# EAGLE design hermes (EAGLE 8.3.0)

## Sheet 1 of 2
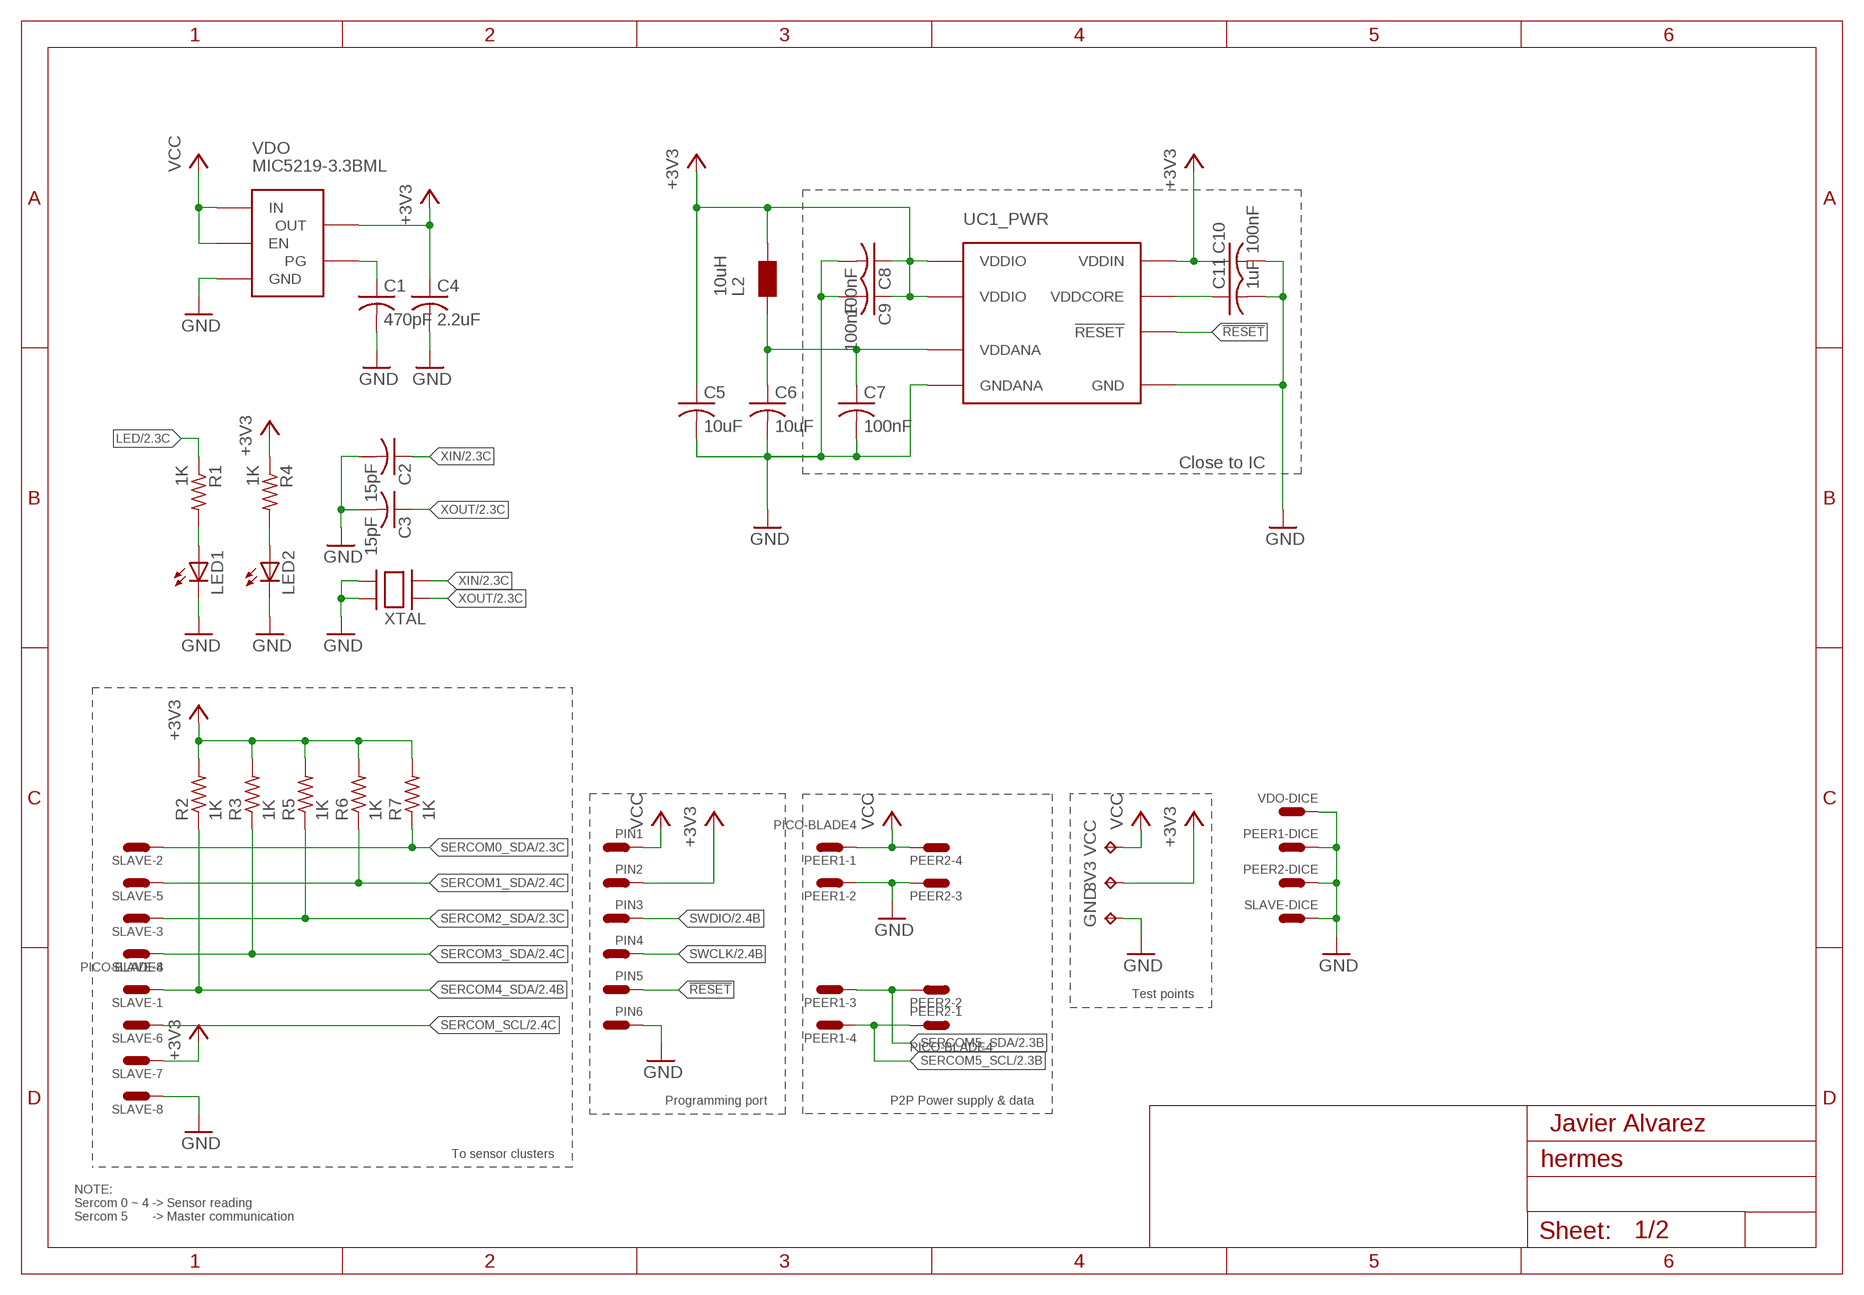
[diagram p0: schematic, sheet 1]

### Parts
3V3  TPB1,27  [B1,27]
C1  470pF  C-USC0201  [C0201]
C2  15pF  C-USC0201  [C0201]
C3  15pF  C-USC0201  [C0201]
C4  2.2uF  C-USC0201  [C0201]
C5  10uF  C-USC0402  [C0402]
C6  10uF  C-USC0402  [C0402]
C7  100nF  C-USC0201  [C0201]
C8  100nF  C-USC0201  [C0201]
C9  100nF  C-USC0201  [C0201]
C10  100nF  C-USC0201  [C0201]
C11  1uF  C-USC0201  [C0201]
GND  TPB1,27  [B1,27]
L2  10uH  SPM5030-HZ  [L2215]
LED1  LED_ESML0603  [LED_SML0603]
LED2  LED_ESML0603  [LED_SML0603]
PEER1  PICO-BLADE4  [PICO-BLADE4]
PEER2  PICO-BLADE4  [PICO-BLADE4]
PIN1  SINGLE-PIN  [PAD5025]
PIN2  SINGLE-PIN  [PAD5025]
PIN3  SINGLE-PIN  [PAD5025]
PIN4  SINGLE-PIN  [PAD5025]
PIN5  SINGLE-PIN  [PAD5025]
PIN6  SINGLE-PIN  [PAD5025]
R1  1K  R-US_R0201  [R0201]
R2  1K  R-US_R0201  [R0201]
R3  1K  R-US_R0201  [R0201]
R4  1K  R-US_R0201  [R0201]
R5  1K  R-US_R0201  [R0201]
R6  1K  R-US_R0201  [R0201]
R7  1K  R-US_R0201  [R0201]
SLAVE  PICO-BLADE8  [PICO-BLADE8]
UC1  ATSAMD20G-QFN48  [QFN-48]
VCC  TPB1,27  [B1,27]
VDO  MIC5219-3.3BML  [MLF-6]
XTAL  LFXTAL059596CUTT  [2X1.6]

### Nets
!RESET: PIN5.P$1 UC1.P$40(_PWR:!RESET)
+3V3: 3V3.TP C4.1 C5.1 C8.1 C9.1 C10.1 L2.P$2 PIN2.P$1 R2.2 R3.2 R4.1 R5.2 R6.2 R7.2 SLAVE.P$9 UC1.P$17(_PWR:VDDIO) UC1.P$36(_PWR:VDDIO) UC1.P$44(_PWR:VDDIN) VDO.P$4(OUT)
GND: C1.2 C2.2 C3.2 C4.2 C5.2 C6.2 C7.2 C8.2 C9.2 C10.2 C11.2 GND.TP LED1.C LED2.C PEER1.P$1 PEER1.P$2 PEER1.P$4 PEER2.P$1 PEER2.P$2 PEER2.P$5 PIN6.P$1 SLAVE.P$1 SLAVE.P$2 SLAVE.P$10 UC1.P$5(_PWR:GNDANA) UC1.P$18(_PWR:GND) UC1.P$35(_PWR:GND) UC1.P$42(_PWR:GND) UC1.P$49(_PWR:GND) VDO.P$2(GND) VDO.P$7 XTAL.GND@1(GND) XTAL.GND@2(GND)
LED: R1.1 ; also sheet 2
N$1: C6.1 C7.1 L2.P$1 UC1.P$6(_PWR:VDDANA)
N$2: C1.1 VDO.P$6(PG)
N$3: C11.1 UC1.P$43(_PWR:VDDCORE)
N$6: LED1.A R1.2
N$7: LED2.A R4.2
SERCOM0_SDA: R7.1 SLAVE.P$4 ; also sheet 2
SERCOM1_SDA: R6.1 SLAVE.P$7 ; also sheet 2
SERCOM2_SDA: R5.1 SLAVE.P$5 ; also sheet 2
SERCOM3_SDA: R3.1 SLAVE.P$6 ; also sheet 2
SERCOM4_SDA: R2.1 SLAVE.P$3 ; also sheet 2
SERCOM5_SCL: PEER1.P$6 PEER2.P$3 ; also sheet 2
SERCOM5_SDA: PEER1.P$5 PEER2.P$4 ; also sheet 2
SERCOM_SCL: SLAVE.P$8 ; also sheet 2
SWCLK: PIN4.P$1 ; also sheet 2
SWDIO: PIN3.P$1 ; also sheet 2
VCC: PEER1.P$3 PEER2.P$6 PIN1.P$1 VCC.TP VDO.P$1(EN) VDO.P$3(IN)
XIN: C2.1 XTAL.XTAL@1(XTAL) ; also sheet 2
XOUT: C3.1 XTAL.XTAL@2(XTAL) ; also sheet 2

### Notes on the sheet
- Close to IC
- Test points
- Programming port | P2P Power supply & data
- Javier Alvarez
- To sensor clusters
- NOTE:
  Sercom 0 ~ 4 -> Sensor reading
  Sercom 5       -> Master communication

## Sheet 2 of 2
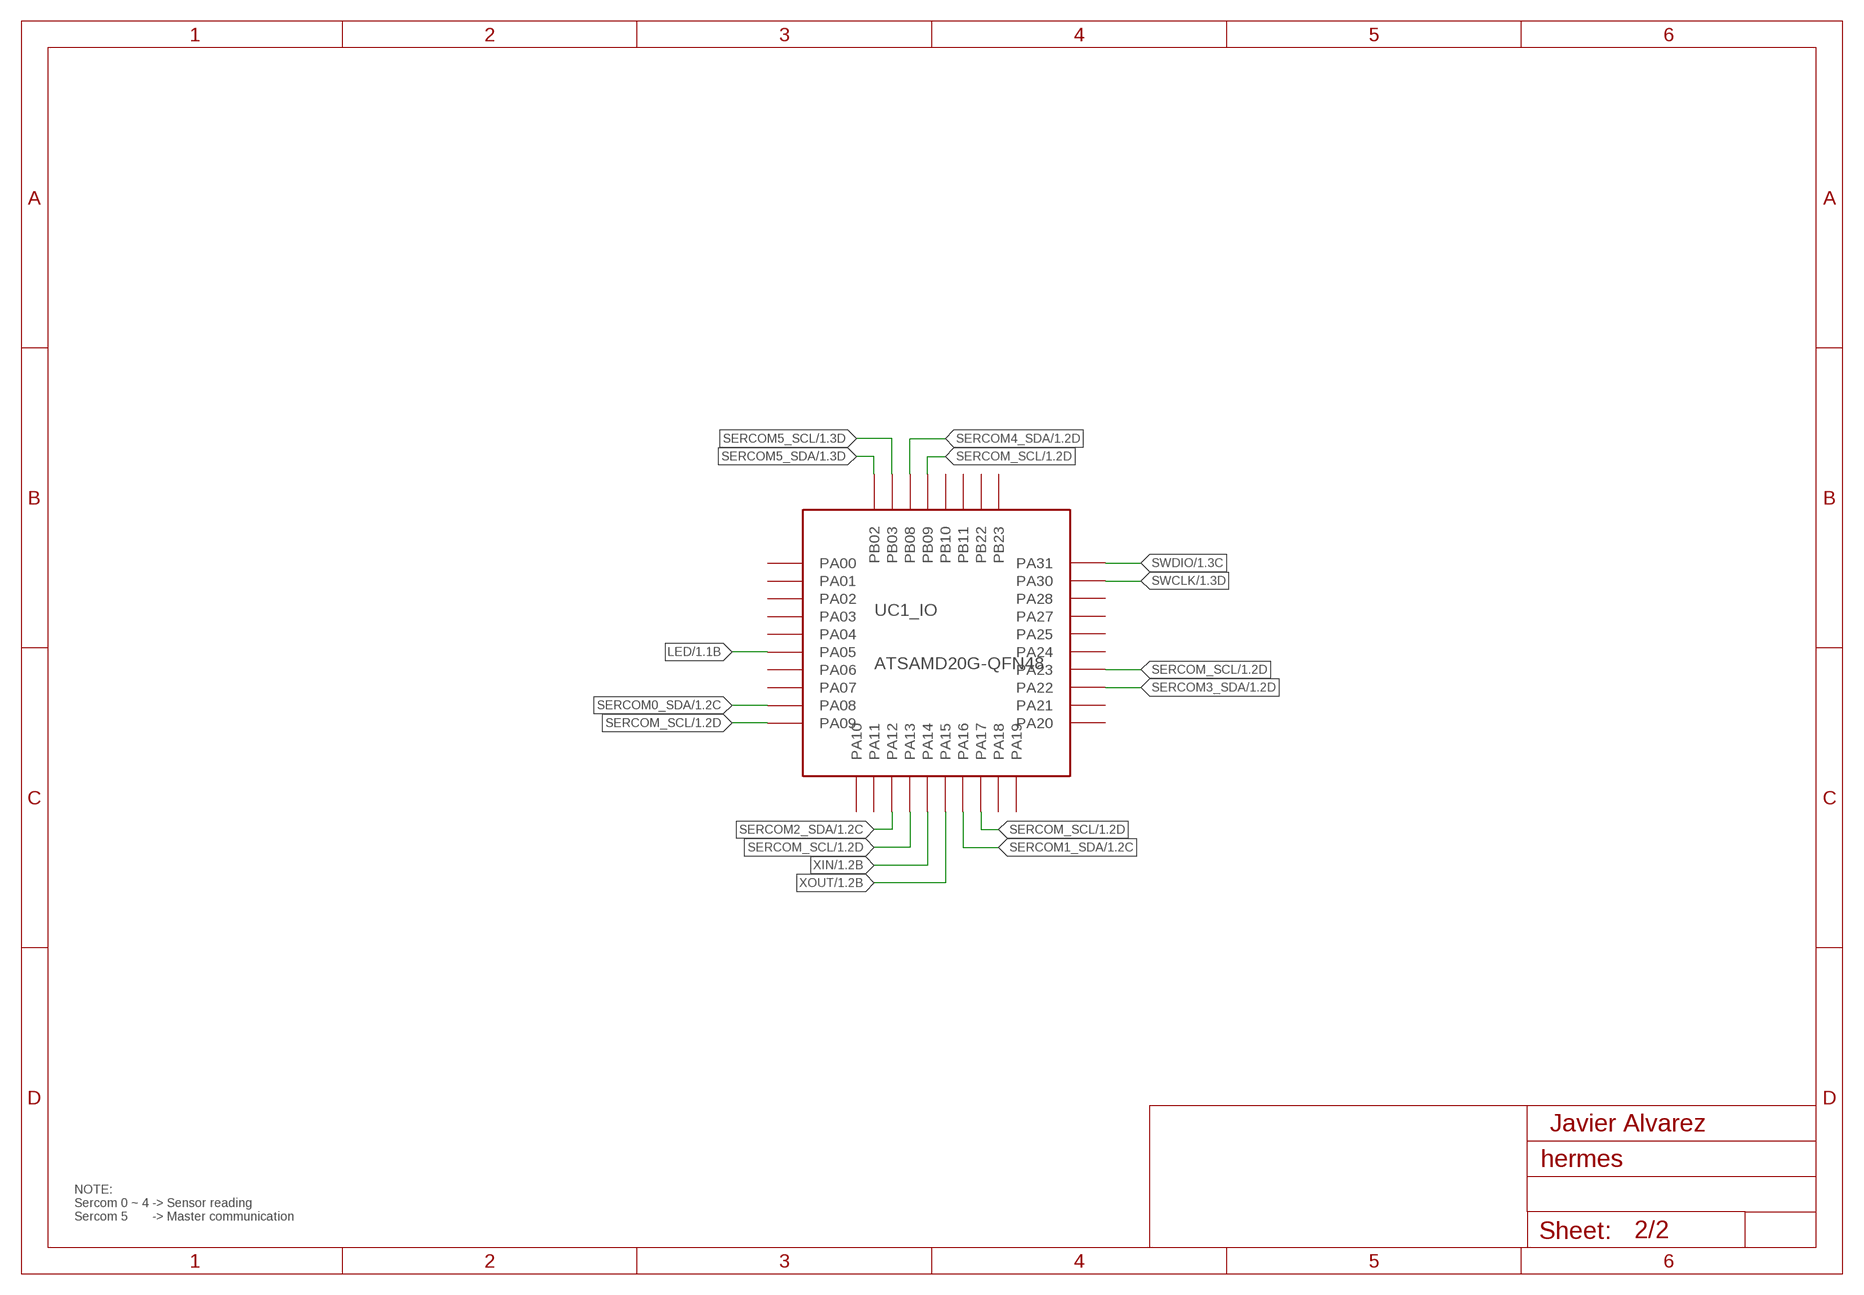
[diagram p1: schematic, sheet 2]

### Nets
LED: UC1.P$10(_IO:PA05) ; also sheet 1
SERCOM0_SDA: UC1.P$13(_IO:PA08) ; also sheet 1
SERCOM1_SDA: UC1.P$25(_IO:PA16) ; also sheet 1
SERCOM2_SDA: UC1.P$21(_IO:PA12) ; also sheet 1
SERCOM3_SDA: UC1.P$31(_IO:PA22) ; also sheet 1
SERCOM4_SDA: UC1.P$7(_IO:PB08) ; also sheet 1
SERCOM5_SCL: UC1.P$48(_IO:PB03) ; also sheet 1
SERCOM5_SDA: UC1.P$47(_IO:PB02) ; also sheet 1
SERCOM_SCL: UC1.P$8(_IO:PB09) UC1.P$14(_IO:PA09) UC1.P$22(_IO:PA13) UC1.P$26(_IO:PA17) UC1.P$32(_IO:PA23) ; also sheet 1
SWCLK: UC1.P$45(_IO:PA30) ; also sheet 1
SWDIO: UC1.P$46(_IO:PA31) ; also sheet 1
XIN: UC1.P$23(_IO:PA14) ; also sheet 1
XOUT: UC1.P$24(_IO:PA15) ; also sheet 1
Unconnected: UC1.P$1(_IO:PA00) UC1.P$2(_IO:PA01) UC1.P$3(_IO:PA02) UC1.P$4(_IO:PA03) UC1.P$9(_IO:PA04) UC1.P$11(_IO:PA06) UC1.P$12(_IO:PA07) UC1.P$15(_IO:PA10) UC1.P$16(_IO:PA11) UC1.P$19(_IO:PB10) UC1.P$20(_IO:PB11) UC1.P$27(_IO:PA18) UC1.P$28(_IO:PA19) UC1.P$29(_IO:PA20) UC1.P$30(_IO:PA21) UC1.P$33(_IO:PA24) UC1.P$34(_IO:PA25) UC1.P$37(_IO:PB22) UC1.P$38(_IO:PB23) UC1.P$39(_IO:PA27) UC1.P$41(_IO:PA28)

### Notes on the sheet
- Javier Alvarez
- NOTE:
  Sercom 0 ~ 4 -> Sensor reading
  Sercom 5       -> Master communication

## Library data of the parts
3V3 GND VCC = testpad:TP: Test pad
C1-C11 = rcl:C-US: CAPACITOR, American symbol
L2 = Hermes_lib:SPM5030-HZ
LED1 LED2 = eagle-ltspice:LED_E: LED Source: http://www.osram.convergy.de Source: www.luxeon.com Source: www.kingbright.com; SPICEMODEL: NONE; SPICEPREFIX: D; SPICETYPE: diode
PEER1 PEER2 = Hermes_lib:PICO-BLADE4
PIN1-PIN6 = Hermes_lib:SINGLE-: Single pad 50x25 mil Single general purpose pad
R1-R7 = rcl:R-US_: RESISTOR, American symbol
SLAVE = Hermes_lib:PICO-BLADE8
UC1 = Hermes_lib:ATSAMD20G-: Low-Power, 32-bit Cortex-M0+ MCUs with 12-bit ADC, 10-bit DAC, 256-Channel PTC, RTC, and SERCOM Datasheet <http://ww1.microchip.com/downloads/en/DeviceDoc/60001504B.pdf>
VDO = Hermes_lib:MIC5219-: MIC5219 500mA-Peak Output LDO Regulator Datasheet <http://www.mouser.com/ds/2/268/mic5219-779135.pdf>
XTAL = Hermes_lib:LFXTAL059596CUTT: LFXTAL059596Cutt Quartz Crystal Specification Datasheet <http://www.mouser.com/ds/2/741/LFXTAL059596Cutt-948066.pdf>

## Board
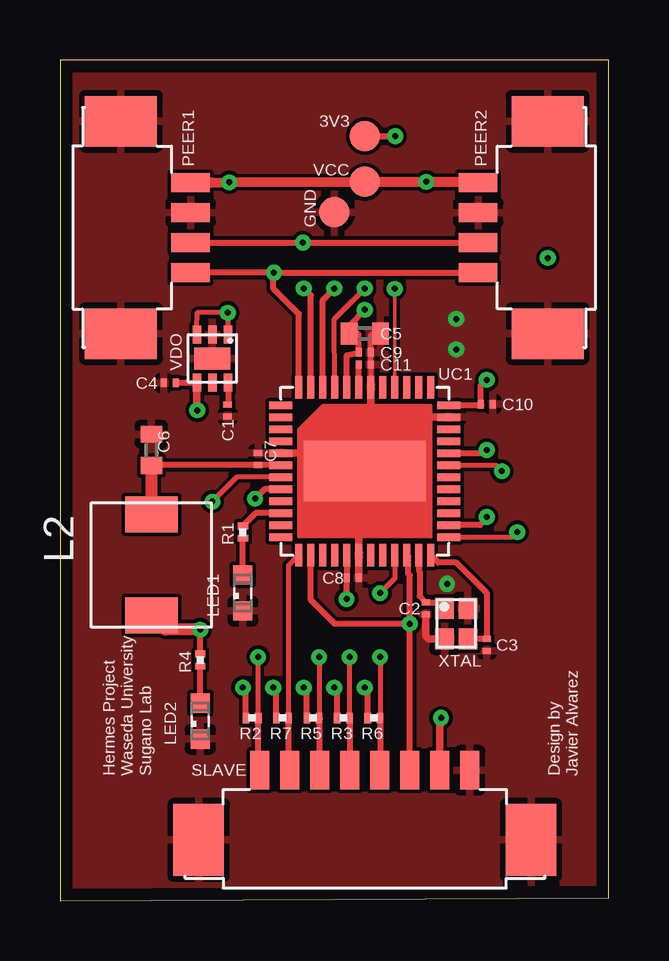
[diagram p2: board, top side]
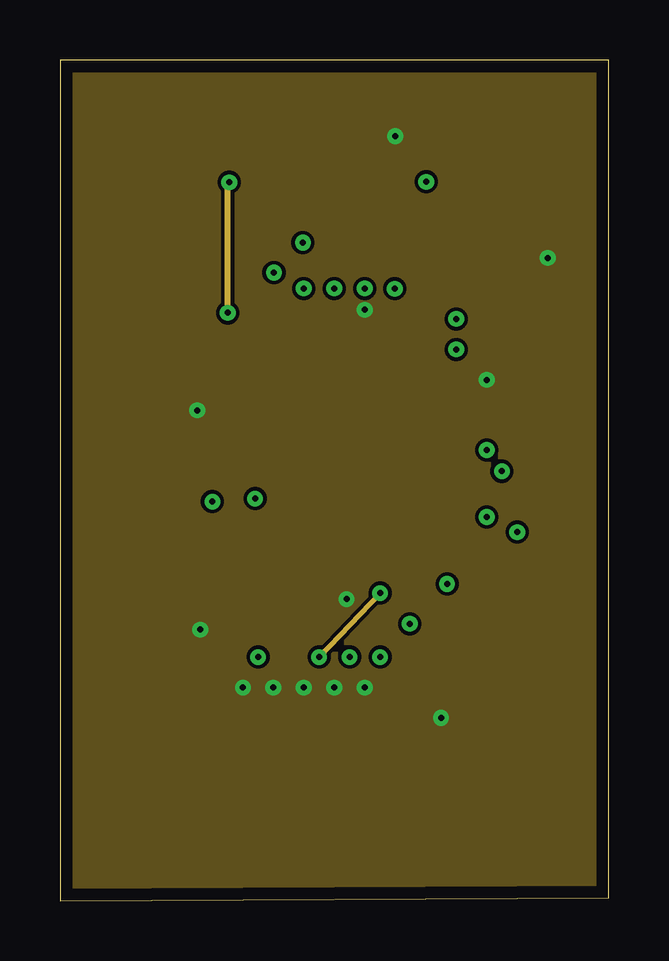
[diagram p3: board, inner layer Route2]
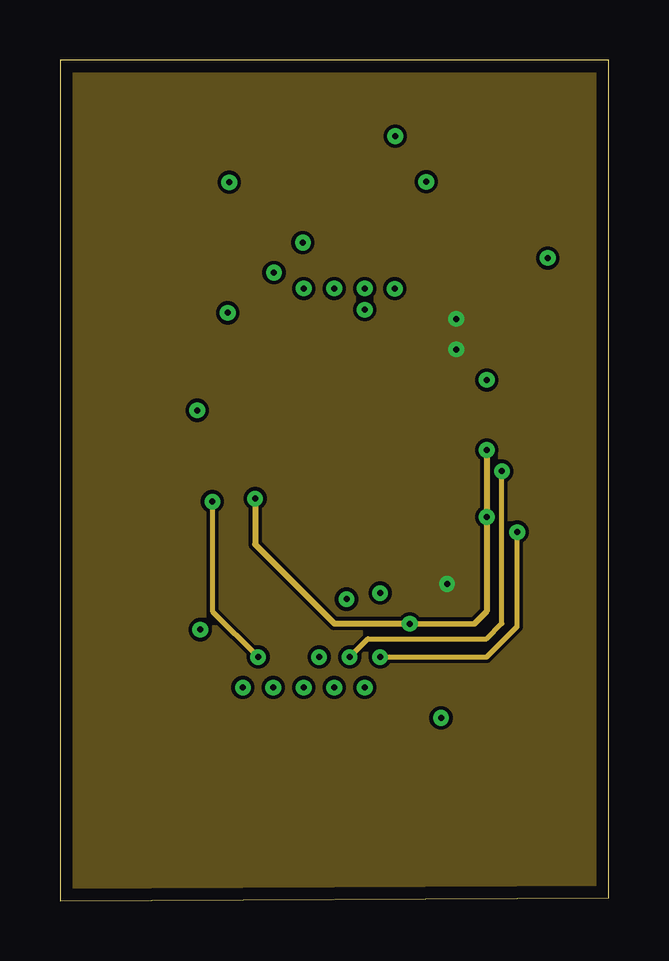
[diagram p4: board, inner layer Route15]
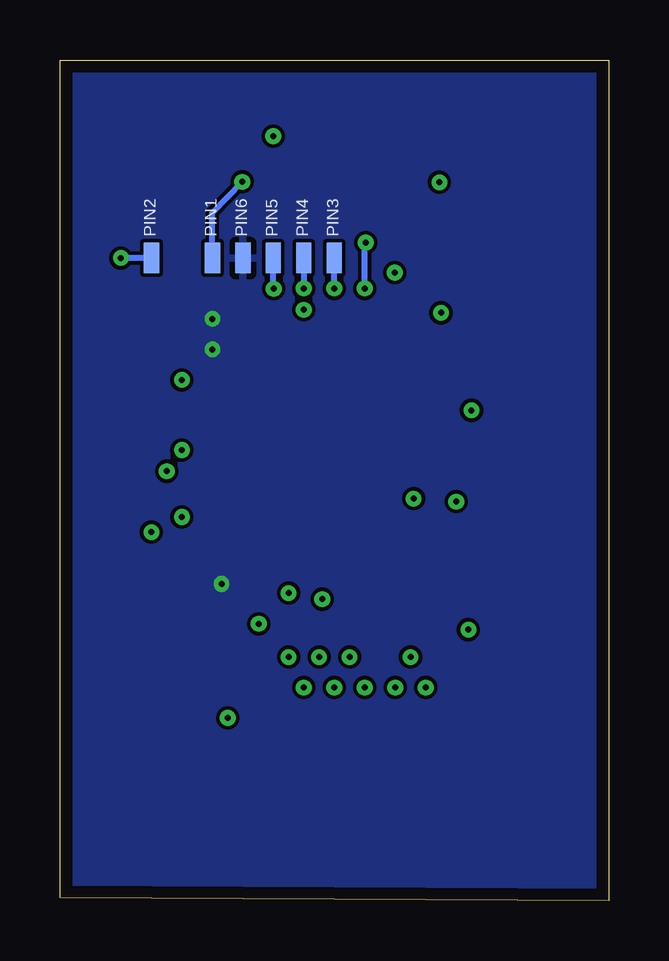
[diagram p5: board, bottom side, seen from below]

Size 22.86 x 35.05 mm. Coordinates in mm from the lower left corner, seen from the top.
Outline: 0,0 22.86,0.13 22.86,35.05 0,35.04 0,0
Copper layers (1*2*15*16): Top 0.035mm / dielectric 1.5mm / Route2 0.035mm / dielectric 0.15mm / Route15 0.035mm / dielectric 0.2mm / Bottom 0.035mm
Design rules "default *": minimum track width 6mil, minimum drill 0.35mm, track to track 6mil, track to pad 6mil, pad to pad 6mil, via to via 6mil, smd to smd 6mil, copper to edge 20mil, drill to drill 6mil, minimum pad ring 10mil, minimum via ring 8mil, stop-mask expansion 4mil, vias tented up to drill 0mil, thermal gap 10mil

### Footprints (pad centres in the part's own frame; a part is rotated, then mirrored left to right if it is on the bottom)
B1,27 = smd 1.27 x 1.27: TP 0,0
C0201 = smd 0.25 x 0.35: 1 -0.25,0; 2 0.25,0
C0402 = smd 0.7 x 0.9: 1 -0.65,0; 2 0.65,0
L2215 = smd 1.5 x 2.2: P$1 -2,0; P$2 2.2,0
LED_SML0603 = smd 0.8 x 0.8: A 0.75,0; C -0.75,0
PICO-BLADE4 = smd 2.1 x 3: P$1 -4.425,0; P$2 4.425,0 | smd 0.8 x 1.6: P$3 -1.875,2.9; P$4 -0.625,2.9; P$5 0.625,2.9; P$6 1.875,2.9
PAD5025 = smd 1.27 x 0.635: P$1 0,0
R0201 = smd 0.28 x 0.43: 1 -0.255,0; 2 0.255,0
PICO-BLADE8 = smd 2.1 x 3: P$1 -6.925,0; P$2 6.925,0 | smd 0.8 x 1.6: P$3 -4.375,2.9; P$4 -3.125,2.9; P$5 -1.875,2.9; P$6 -0.625,2.9; P$7 0.625,2.9; P$8 1.875,2.9; P$9 3.125,2.9; P$10 4.375,2.9
QFN-48 = smd 0.95 x 0.3: P$1 -3.5,2.75; P$2 -3.5,2.25; P$3 -3.5,1.75; P$4 -3.5,1.25; P$5 -3.5,0.75; P$6 -3.5,0.25; P$7 -3.5,-0.25; P$8 -3.5,-0.75; P$9 -3.5,-1.25; P$10 -3.5,-1.75; P$11 -3.5,-2.25; P$12 -3.5,-2.75; P$25 3.5,-2.75; P$26 3.5,-2.25; P$27 3.5,-1.75; P$28 3.5,-1.25; P$29 3.5,-0.75; P$30 3.5,-0.25; P$31 3.5,0.25; P$32 3.5,0.75; P$33 3.5,1.25; P$34 3.5,1.75; P$35 3.5,2.25; P$36 3.5,2.75 | smd 0.3 x 0.95: P$13 -2.75,-3.5; P$14 -2.25,-3.5; P$15 -1.75,-3.5; P$16 -1.25,-3.5; P$17 -0.75,-3.5; P$18 -0.25,-3.5; P$19 0.25,-3.5; P$20 0.75,-3.5; P$21 1.25,-3.5; P$22 1.75,-3.5; P$23 2.25,-3.5; P$24 2.75,-3.5; P$37 2.75,3.5; P$38 2.25,3.5; P$39 1.75,3.5; P$40 1.25,3.5; P$41 0.75,3.5; P$42 0.25,3.5; P$43 -0.25,3.5; P$44 -0.75,3.5; P$45 -1.25,3.5; P$46 -1.75,3.5; P$47 -2.25,3.5; P$48 -2.75,3.5 | smd 5.08 x 2.54: P$49 0,0
MLF-6 = smd 0.75 x 0.35: P$1 -1,0.65; P$2 -1,0; P$3 -1,-0.65; P$4 1,-0.65; P$5 1,0; P$6 1,0.65 | smd 0.9 x 1.5: P$7 0,0
2X1.6 = smd 0.875 x 0.775: GND@1 0.637,-0.487; GND@2 -0.637,0.487; XTAL@1 -0.637,-0.487; XTAL@2 0.637,0.487

### Placement (x,y rotation side)
3V3  12.7,31.88 0 top
C1  6.98,20.45 270 top
C2  15.24,12.19 270 top
C3  17.78,10.67 270 top
C4  4.57,21.59 180 top
C5  12.7,23.65 0 top
C6  3.81,18.8 90 top
C7  8.26,18.41 90 top
C8  12.19,13.46 0 top
C9  12.7,22.86 0 top
C10  17.78,20.7 0 top
C11  12.7,22.35 0 top
GND  11.43,28.7 0 top
L2  3.81,14.1 270 top
LED1  7.62,12.83 90 top
LED2  5.84,7.49 90 top
PEER1  2.54,28.07 270 top
PEER2  20.32,28.07 90 top
PIN1  16.51,26.8 90 bottom
PIN2  19.05,26.8 90 bottom
PIN3  11.43,26.8 90 bottom
PIN4  12.7,26.8 90 bottom
PIN5  13.97,26.8 90 bottom
PIN6  15.24,26.8 90 bottom
R1  7.62,15.37 270 top
R2  8,7.62 180 top
R3  11.81,7.62 180 top
R4  5.84,10.03 270 top
R5  10.54,7.62 180 top
R6  13.08,7.62 180 top
R7  9.27,7.62 180 top
SLAVE  12.7,2.54 0 top
UC1  12.7,17.91 0 top
VCC  12.7,29.97 0 top
VDO  6.35,22.61 270 top
XTAL  16.51,11.56 270 top

### Tracks (layer width: path | path; a pad name or v marks a point on that pad's centre or on a via)
!RESET  (via drill 0.25)
  Top 0.152: UC1.P$40 v13.95,25.51
  Bottom 0.254: v13.95,25.51 13.97,25.53 PIN5.P$1
+3V3  (via drill 0.25)
  Top 0.254: VDO.P$4 4.84,21.61 C4.1 | UC1.P$36 17.57,20.66 C10.1 17.53,21.47 v17.78,21.72 | UC1.P$17 11.93,14.39 C8.1 11.93,13.08 v11.94,12.57 | R4.1 v5.84,11.3 | 3V3.TP v13.97,31.88 | UC1.P$44 11.95,22.74 C9.1 12.45,23.62 C5.1 12.07,24 v12.7,24.64 | R2.2 7.75,8.76 v7.62,8.89 | R7.2 9.02,8.76 v8.89,8.89 | R5.2 10.29,8.76 v10.16,8.89 | R3.2 11.56,8.76 v11.43,8.89 | R6.2 12.83,8.76 v12.7,8.89
  Top 0.305: VDO.P$4 5.7,20.46 v5.72,20.45 | SLAVE.P$9 15.83,7.57 v15.88,7.62
  Top 0.508: v5.84,11.3 4.4,11.3 L2.P$2
  Bottom 0.254: PIN2.P$1 v20.32,26.8
  pour Route2: 0,35.05 0,0 22.86,0 22.86,35.05
GND  (via drill 0.25)
  Top 0.203: UC1.P$42 C11.2 C9.2 12.95,23.62 C5.2 | 11.95,18.66 UC1.P$49
  Top 0.305: UC1.P$49 12.45,17.66 UC1.P$18 C8.2 | UC1.P$5 11.95,18.66 | UC1.P$42 12.95,18.16 UC1.P$49 | UC1.P$35 14.95,20.16 UC1.P$49 | C2.2 15.24,11.05 15.37,10.92 XTAL.GND@1
  other vias: 16.51,22.99 16.13,13.21 16.51,24.26
  pour Top: 0,35.05 0,0 22.86,0 22.86,35.05
  pour Bottom: 0,35.05 0,0 22.86,0 22.86,35.05
  pour Route15: 0,0 0,35.05 22.86,35.05 22.86,0
LED
  Top 0.254: UC1.P$10 8.16,16.16 R1.1
N$1
  Top 0.254: UC1.P$6 C7.1 3.83,18.16 C6.1
  Top 0.508: C6.1 L2.P$1
N$2
  Top 0.254: VDO.P$6 7,20.71 C1.1
N$3
  Top 0.254: UC1.P$43 C11.1
N$6
  Top 0.254: LED1.A R1.2
N$7
  Top 0.254: LED2.A R4.2
SERCOM0_SDA
  Top 0.203: R7.1 9.53,13.98 UC1.P$13
  Top 0.254: R7.1 9.53,5.49 SLAVE.P$4
SERCOM1_SDA  (via drill 0.25)
  Top 0.203: UC1.P$25 18.84,15.16 v19.05,15.37 | v13.34,10.16 R6.1
  Top 0.254: R6.1 13.34,5.45 SLAVE.P$7
  Route15 0.203: v13.34,10.16 17.78,10.16 19.05,11.43 v19.05,15.37
SERCOM2_SDA  (via drill 0.25)
  Top 0.203: UC1.P$21 13.95,13.44 v13.34,12.83 | v10.8,10.16 R5.1
  Top 0.254: 10.83,7.59 R5.1 10.8,5.47 SLAVE.P$5
  Route2 0.203: v13.34,12.83 v10.8,10.16
SERCOM3_SDA  (via drill 0.25)
  Top 0.203: UC1.P$31 18.16,18.16 v18.41,17.91 | v12.07,10.16 R3.1
  Top 0.254: R3.1 12.07,5.45 SLAVE.P$6
  Route15 0.203: v18.41,17.91 18.41,11.56 17.78,10.92 12.83,10.92 v12.07,10.16
SERCOM4_SDA  (via drill 0.25)
  Top 0.203: UC1.P$7 7.37,17.66 v6.35,16.64 | R2.1 v8.26,10.16
  Top 0.254: R2.1 8.26,5.51 SLAVE.P$3
  Route15 0.203: v6.35,16.64 6.35,12.06 v8.26,10.16
SERCOM5_SCL  (via drill 0.25)
  Top 0.254: v8.92,26.19 PEER2.P$3 | v8.92,26.19 PEER1.P$6 | UC1.P$48 9.95,24.47 8.89,25.53 8.89,26.17 v8.92,26.19
SERCOM5_SDA  (via drill 0.25)
  Top 0.254: PEER1.P$5 v10.12,27.44 PEER2.P$4 | UC1.P$47 10.45,25.24 v10.16,25.53
  Bottom 0.254: v10.16,25.53 10.16,27.4 v10.12,27.44
SERCOM_SCL  (via drill 0.25)
  Top 0.254: SLAVE.P$8 v14.58,11.55 | v14.58,11.55 14.58,13.55 14.52,13.61 14.52,14.34 UC1.P$22 | 14.57,11.56 v14.58,11.55 | UC1.P$14 10.45,12.54 11.44,11.55 v14.58,11.55 | UC1.P$26 17.49,15.66 v17.78,16 | UC1.P$8 8.52,17.16 v8.13,16.76 | UC1.P$32 17.66,18.66 v17.78,18.8
  Route15 0.254: v8.13,16.76 8.13,14.86 11.43,11.56 14.57,11.56 v14.58,11.55 17.27,11.56 17.78,12.06 v17.78,16 v17.78,18.8
SWCLK  (via drill 0.25)
  Top 0.203: UC1.P$45 11.43,24.26 v12.7,25.53
  Bottom 0.254: PIN4.P$1 v12.7,25.53
SWDIO  (via drill 0.25)
  Top 0.254: UC1.P$46 10.95,25.05 v11.43,25.53
  Bottom 0.254: v11.43,25.53 PIN3.P$1
VCC  (via drill 0.25)
  Top 0.203: VDO.P$3 5.7,23.86 5.72,24.51 v6.98,24.51 7,24.5 VDO.P$1
  Top 0.406: PEER1.P$3 6.32,29.94 v7.05,29.95 VCC.TP v15.26,29.97 17.39,29.97 PEER2.P$6
  Route2 0.254: v7.05,29.95 6.98,29.89 v6.98,24.51
  Bottom 0.254: PIN1.P$1 16.51,28.68 v15.26,29.97
XIN
  Top 0.254: UC1.P$23 14.95,13.75 14.98,13.72 14.98,12.7 C2.1 15.77,12.44 XTAL.XTAL@1
XOUT
  Top 0.254: XTAL.XTAL@2 17.38,10.92 C3.1 17.78,12.83 16.51,14.1 15.76,14.1 UC1.P$24

### Text on the board
tNames: Hermes Project / Waseda University / Sugano Lab | Design by / Javier Alvarez